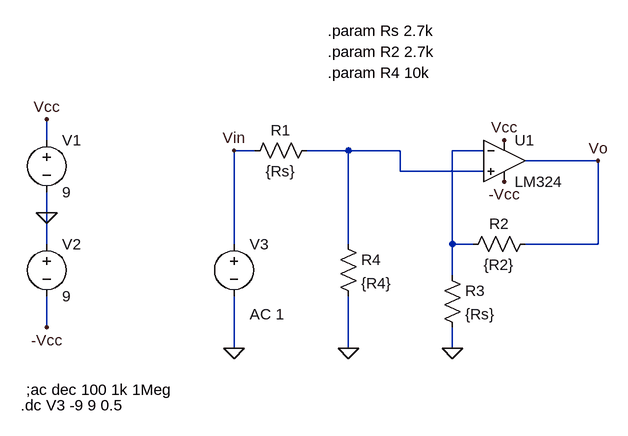
[diagram p0: schematic No_inversor_Caso2.asc]
* No_inversor_Caso2.asc
* U1: LM324 (symbol sympropio\LM324 not available, pins judged from their places): In+=N001 In-=N002 V+=Vcc V-=-Vcc OUT=Vo
V1 Vcc 0 9
V2 0 -Vcc 9
V3 Vin 0 AC 1
R1 N001 Vin {Rs}
R4 N001 0 {R4}
R3 N002 0 {Rs}
R2 Vo N002 {R2}
.param Rs 2.7k
.param R2 2.7k
.param R4 10k
;ac dec 100 1k 1Meg
.dc V3 -9 9 0.5
.backanno
.end

* Results of the author's LTspice run, read from the files saved beside the schematic
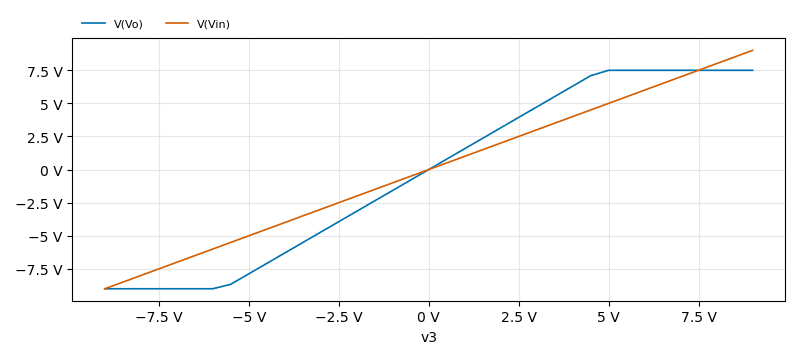
[diagram p1: DC transfer characteristic of No_inversor_Caso2.asc, plotted from the saved traces]
* DC transfer characteristic, 1 run:
*   V(Vo): -8.996 V at v3=-9 V, 7.495 V at v3=9 V, min -8.996 V, max 7.495 V
*   V(Vin): -9 V at v3=-9 V, 9 V at v3=9 V, min -9 V, max 9 V